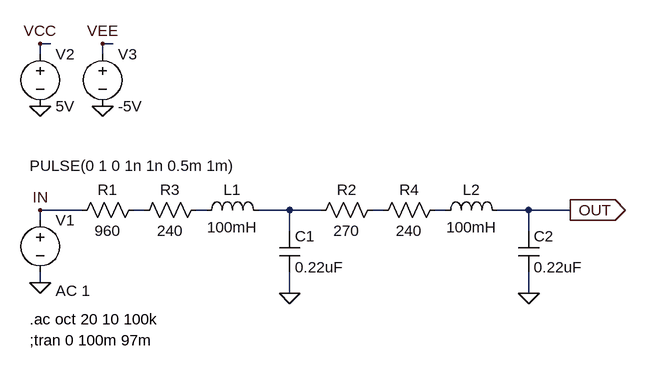
[diagram p0: schematic 4thButterWorthLPF_100mH_NoBuffer_r.asc]
4thButterWorthLPF_100mH_NoBuffer_r.asc, the LTspice schematic file:
Version 4
SHEET 1 964 680
WIRE -32 -128 -48 -128
WIRE 64 -128 48 -128
WIRE -48 -112 -48 -128
WIRE 48 -112 48 -128
WIRE 16 128 -48 128
WIRE 112 128 96 128
WIRE 208 128 192 128
WIRE 336 128 288 128
WIRE 384 128 336 128
WIRE 480 128 464 128
WIRE 576 128 560 128
WIRE 704 128 656 128
WIRE 768 128 704 128
WIRE -48 144 -48 128
WIRE 336 160 336 128
WIRE 704 160 704 128
WIRE -48 240 -48 224
WIRE 336 256 336 224
WIRE 704 256 704 224
FLAG 336 256 0
FLAG -48 240 0
FLAG 768 128 OUT
IOPIN 768 128 Out
FLAG 704 256 0
FLAG -48 -32 0
FLAG 48 -32 0
FLAG -48 -128 VCC
FLAG 48 -128 VEE
FLAG -48 128 IN
SYMBOL ind 192 144 R270
WINDOW 0 32 56 VTop 2
WINDOW 3 5 56 VBottom 2
SYMATTR InstName L1
SYMATTR Value 100mH
SYMBOL res 112 112 R90
WINDOW 0 0 56 VBottom 2
WINDOW 3 32 56 VTop 2
SYMATTR InstName R1
SYMATTR Value 960
SYMBOL cap 320 160 R0
SYMATTR InstName C1
SYMATTR Value 0.22uF
SYMBOL voltage -48 128 R0
WINDOW 123 24 124 Left 2
WINDOW 39 0 0 Left 2
WINDOW 3 -16 -68 Left 2
SYMATTR Value2 AC 1
SYMATTR Value PULSE(0 1 0 1n 1n 0.5m 1m)
SYMATTR InstName V1
SYMBOL ind 560 144 R270
WINDOW 0 32 56 VTop 2
WINDOW 3 5 56 VBottom 2
SYMATTR InstName L2
SYMATTR Value 100mH
SYMBOL res 480 112 R90
WINDOW 0 0 56 VBottom 2
WINDOW 3 32 56 VTop 2
SYMATTR InstName R2
SYMATTR Value 270
SYMBOL cap 688 160 R0
SYMATTR InstName C2
SYMATTR Value 0.22uF
SYMBOL voltage -48 -128 R0
WINDOW 123 0 0 Left 2
WINDOW 39 0 0 Left 2
SYMATTR InstName V2
SYMATTR Value 5V
SYMBOL voltage 48 -128 R0
SYMATTR InstName V3
SYMATTR Value -5V
SYMBOL res 576 112 R90
WINDOW 0 0 56 VBottom 2
WINDOW 3 32 56 VTop 2
SYMATTR InstName R4
SYMATTR Value 240
SYMBOL res 208 112 R90
WINDOW 0 0 56 VBottom 2
WINDOW 3 32 56 VTop 2
SYMATTR InstName R3
SYMATTR Value 240
TEXT -64 296 Left 2 !.ac oct 20 10 100k
TEXT -64 328 Left 2 !;tran 0 100m 97m

The netlist it stands for:
* 4thButterWorthLPF_100mH_NoBuffer_r.asc
L1 N002 N003 100mH
R1 N001 IN 960
C1 N003 0 0.22uF
V1 IN 0 PULSE(0 1 0 1n 1n 0.5m 1m) AC 1
L2 N005 OUT 100mH
R2 N004 N003 270
C2 OUT 0 0.22uF
V2 VCC 0 5V
V3 VEE 0 -5V
R4 N005 N004 240
R3 N002 N001 240
.ac oct 20 10 100k
;tran 0 100m 97m
.backanno
.end